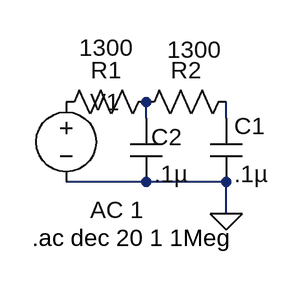
[diagram p0: schematic Draft2.asc]
Draft2.asc, the LTspice schematic file:
Version 4
SHEET 1 880 680
WIRE 32 64 32 48
WIRE 112 64 112 48
WIRE 32 128 -48 128
WIRE 112 128 32 128
WIRE 112 160 112 128
FLAG 112 160 0
SYMBOL res 48 32 R90
WINDOW 0 0 56 VBottom 2
WINDOW 3 -54 56 VTop 2
SYMATTR InstName R1
SYMATTR Value 1300
SYMBOL res 128 32 R90
WINDOW 0 0 56 VBottom 2
WINDOW 3 -52 48 VTop 2
SYMATTR InstName R2
SYMATTR Value 1300
SYMBOL cap 96 64 R0
SYMATTR InstName C1
SYMATTR Value .1µ
SYMBOL cap 16 64 R0
WINDOW 0 21 19 Left 2
SYMATTR InstName C2
SYMATTR Value .1µ
SYMBOL voltage -48 32 R0
WINDOW 123 24 124 Left 2
WINDOW 39 0 0 Left 0
SYMATTR InstName V1
SYMATTR Value ""
SYMATTR Value2 AC 1
TEXT -82 184 Left 2 !.ac dec 20 1 1Meg

The netlist it stands for:
* Draft2.asc
R1 N001 P001 1300
R2 N002 N001 1300
C1 N002 0 .1µ
C2 N001 0 .1µ
V1 P001 0 AC 1
.ac dec 20 1 1Meg
.backanno
.end